# Altium schematic sheet SSFocuser-A-DRV8825.SchDoc
size A4
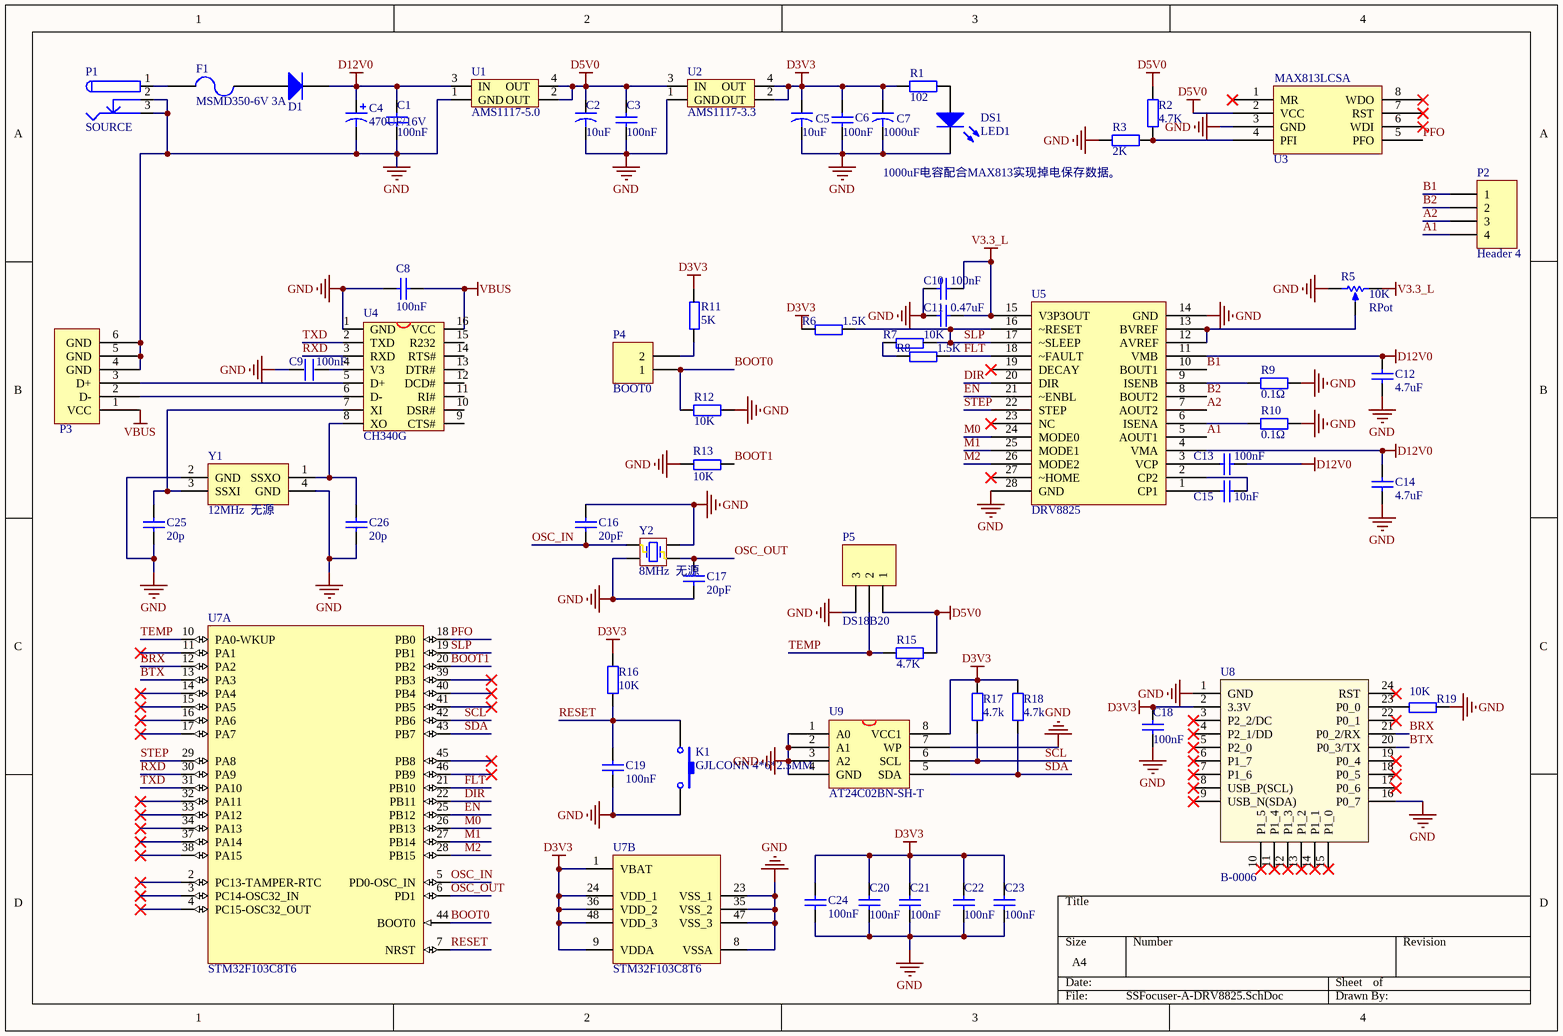
[diagram p0: SSFocuser-A-DRV8825.SchDoc]

## Parts
C1  100nF  [0603C]
C2  10uF  [3216]
C3  100nF  [0603C]
C4  470UF/16V  [16V/470U(CD10X10D5)]
C5  10uF  [3216]
C6  100nF  [0603C]
C7  1000uF  [16V/470U(CD10X10D5)]
C8  100nF  [0603C]
C9  100nF  [0603C]
C10  100nF  [0603C]
C11  0.47uF  [0603C]
C12  4.7uF  [1206C]
C13  100nF  [0603C]
C14  4.7uF  [1206C]
C15  10nF  [0603C]
C16  20pF  [0603C]
C17  20pF  [0603C]
C18  100nF  [0603C]
C19  100nF  [0603C]
C20  100nF  [0603C]
C21  100nF  [0603C]
C22  100nF  [0603C]
C23  100nF  [0603C]
C24  100nF  [0603C]
C25  20p  [0603C]
C26  20p  [0603C]
D1  M7  [DO-214AC]  (value not drawn)
DS1  LED1  [0805D]
F1  MSMD350-6V 3A  [1812R]
K1  GJLCONN 4*6*2.5MM  [SW-4*6]
P1  SOURCE  [DC_5.5MM]
P2  Header 4  [XH_4_V]
P3  USB-B  [USB-B]  (value not drawn)
P4  BOOT0  [HDR1X2]
P5  DS18B20  [TO-92B]
R1  102  [0603R]
R2  4.7K  [0603R]
R3  2K  [0603R]
R5  RPot  value 10K  [VR_SMD]
R6  1.5K  [0603R]
R7  10K  [0603R]
R8  1.5K  [0603R]
R9  0.1Ω  [1206R]
R10  0.1Ω  [1206R]
R11  5K  [0603R]
R12  10K  [0603R]
R13  10K  [0603R]
R15  4.7K  [0603R]
R16  10K  [0603R]
R17  4.7k  [0603R]
R18  4.7k  [0603R]
R19  10K  [0603R]
U1  AMS1117-5.0  [SOT223]
U2  AMS1117-3.3  [SOT223]
U3  MAX813LCSA  [SOP-8]
U4  CH340G  [SO-16]
U5  DRV8825  [HTSSOP]
U7  STM32F103C8T6  [LQFP48_N]  (parts A,B of 2)
U8  B-0006  [B-0006]
U9  AT24C02BN-SH-T  [SOP-8]
Y1  12MHz  无源  [X3225]
Y2  8MHz  无源  [X3225]

## Nets
D3V3: C5.1 C6.2 C7.1 C18.2 C20.2 C21.2 C22.2 C23.2 C24.2 R1.2 R6.1 R11.2 R16.2 R17.2 R18.2 U2.2(OUT) U2.4(OUT) U7.1(VBAT) U7.9(VDDA) U7.24(VDD_1) U7.36(VDD_2) U7.48(VDD_3) U8.2(3.3V) U9.8(VCC1)
D5V0: C2.1 C3.2 P5.1 R2.2 R15.2 U1.2(OUT) U1.4(OUT) U2.3(IN) U3.2(VCC)
D12V0: C1.2 C4.1 C12.1 C13.1 C14.1 D1.2(K) U1.3(IN) U5.4(VMA) U5.11(VMB)
GND: C1.1 C2.2 C3.1 C4.2 C5.2 C6.1 C7.2 C8.1 C9.1 C10.1 C11.1 C12.2 C14.2 C16.2 C17.2 C18.1 C19.1 C20.1 C21.1 C22.1 C23.1 C24.1 C25.2 C26.2 DS1.2(K) K1.2 P1.2 P1.3 P3.4(GND) P3.5(GND) P3.6(GND) P5.3 R3.2 R5.1(TOP) R9.1 R10.1 R12.2 R13.1 R19.2 U1.1(GND) U2.1(GND) U3.3(GND) U4.1(GND) U5.14(GND) U5.28(GND) U7.8(VSSA) U7.23(VSS_1) U7.35(VSS_2) U7.47(VSS_3) U8.1(GND) U8.16(P0_7) U9.1(A0) U9.2(A1) U9.3(A2) U9.4(GND) U9.7(WP) Y1.2(GND) Y1.4(GND) Y2.2(NA) Y2.4(NA)
V3.3_L: C10.2 C11.2 R5.2(BOT) U5.15(V3P3OUT)
VBUS: C8.2 P3.1(VCC) U4.16(VCC)
A1: P2.4 U5.5(AOUT1)
A2: P2.3 U5.7(AOUT2)
B1: P2.1 U5.10(BOUT1)
B2: P2.2 U5.8(BOUT2)
BOOT0: P4.1 R12.1 U7.44(BOOT0)
BOOT1: R13.2 U7.20(PB2)
BRX: U7.12(PA2) U8.21(P0_2/RX)
BTX: U7.13(PA3) U8.20(P0_3/TX)
DIR: U5.20(DIR) U7.22(PB11)
EN: U5.21(~ENBL) U7.25(PB12)
FLT: R8.2 U5.18(~FAULT) U7.21(PB10)
M0: U5.24(MODE0) U7.26(PB13)
M1: U5.25(MODE1) U7.27(PB14)
M2: U5.26(MODE2) U7.28(PB15)
OSC_IN: C16.1 U7.5(PD0-OSC_IN) Y2.1(OSC1)
OSC_OUT: C17.1 U7.6(PD1) Y2.3(OSC2)
PFO: U3.5(PFO) U7.18(PB0)
RESET: C19.2 K1.1 R16.1 U7.7(NRST)
RXD: U4.3(RXD) U7.30(PA9)
SCL: R17.1 U7.42(PB6) U9.6(SCL)
SDA: R18.1 U7.43(PB7) U9.5(SDA)
SLP: R6.2 R7.2 U5.16(~RESET) U5.17(~SLEEP) U7.19(PB1)
STEP: U5.22(STEP) U7.29(PA8)
TEMP: P5.2 R15.1 U7.10(PA0-WKUP)
TXD: U4.2(TXD) U7.31(PA10)
NetC9_2: C9.2 U4.4(V3)
NetC13_2: C13.2 U5.3(VCP)
NetC15_1: C15.1 U5.2(CP2)
NetC15_2: C15.2 U5.1(CP1)
NetC25_1: C25.1 U4.7(XI) Y1.3(SSXI)
NetC26_1: C26.1 U4.8(XO) Y1.1(SSXO)
NetD1_1: D1.1(A) F1.1
NetDS1_1: DS1.1(A) R1.1
NetF1_2: F1.2 P1.1
NetP3_2: P3.2(D-) U4.6(D-)
NetP3_3: P3.3(D+) U4.5(D+)
NetP4_2: P4.2 R11.1
NetR2_1: R2.1 R3.1 U3.4(PFI)
NetR5_3: R5.3(TAP) U5.12(AVREF) U5.13(BVREF)
NetR7_1: R7.1 R8.1
NetR9_2: R9.2 U5.9(ISENB)
NetR10_2: R10.2 U5.6(ISENA)
NetR19_1: R19.1 U8.23(P0_0)

Not connected (* = marked no-connect by the designer): U3 1(MR)* 6(WDI)* 7(RST)* 8(WDO)*; U4 9(CTS#) 10(DSR#) 11(RI#) 12(DCD#) 13(DTR#) 14(RTS#) 15(R232); U5 19(DECAY)* 23(NC)* 27(~HOME)*; U7 2(PC13-TAMPER-RTC)* 3(PC14-OSC32_IN)* 4(PC15-OSC32_OUT)* 11(PA1)* 14(PA4)* 15(PA5)* 16(PA6)* 17(PA7)* 32(PA11)* 33(PA12)* 34(PA13)* 37(PA14)* 38(PA15)* 39(PB3)* 40(PB4)* 41(PB5)* 45(PB8)* 46(PB9)*; U8 3(P2_2/DC)* 4(P2_1/DD)* 5(P2_0)* 6(P1_7)* 7(P1_6)* 8(USB_P(SCL))* 9(USB_N(SDA))* 10(P1_5)* 11(P1_4)* 12(P1_3)* 13(P1_2)* 14(P1_1)* 15(P1_0)* 17(P0_6)* 18(P0_5)* 19(P0_4)* 22(P0_1)* 24(RST)*

## Notes on the sheet
- 1000uF电容配合MAX813实现掉电保存数据。

## Library data of the parts
C1 C3 C6 C8 C10-C26 = Cap: Capacitor; Published: 8-Jun-2000; LatestRevisionDate: 17-Jul-2002; LatestRevisionNote: Re-released for DXP Platform.; PackageReference: RAD-0.3; Publisher: Altium Limited
  C1 C3 C6 C8 C10 C13 C18-C24: Value: 100nF
  C11: Value: 0.47uF
  C12 C14: Value: 4.7uF
  C15: Value: 10nF
  C16 C17: Value: 20pF
  C25 C26: Value: 20p
C2 C5 C7 = CAP2
  C2 C5: vaule: 10uF
  C7: vaule: 1000uF
C4 = C470UF016S: 470UF      16V      CD10X10D5
C9 = C
D1 = Diode: High Conductance Fast Diode; pin to pad: 1>2 2>1; Published: 8-Jun-2000; LatestRevisionDate: 17-Jul-2002; LatestRevisionNote: Re-released for DXP Platform.; DatasheetDocument: 1997; PackageReference: DO-35; Publisher: Altium Limited; Code_JEDEC: DO-204-AH; ComponentLink1Description: Manufacturer Link; ComponentLink1URL: http://www.fairchildsemi.com/; ComponentLink2Description: Datasheet; ComponentLink2URL: http://www.fairchildsemi.com/ds/1N%2F1N4448.pdf
DS1 = LED2: Typical RED, GREEN, YELLOW, AMBER GaAs LED; Published: 8-Jun-2000; LatestRevisionDate: 17-Jul-2002; LatestRevisionNote: Re-released for DXP Platform.; PackageDocument: Feb-2002; PackageReference: 3.2X1.6X1.1; Publisher: Altium Limited
F1 = FUSE2: Fuse
K1 = KEY2: Switch; Published: 24-Mar-1999; LatestRevisionDate: 17-Jul-2002; LatestRevisionNote: Re-released for DXP Platform.; PackageReference: SPST-2; Publisher: Altium Limited
P2 = Header 4: Header, 4-Pin; LatestRevisionDate: 17-Jul-2002; LatestRevisionNote: Re-released for DXP Platform.; Publisher: Altium Limited
P4 = MHDR1X2: Header, 2-Pin; LatestRevisionDate: 17-Jul-2002; LatestRevisionNote: Re-released for DXP Platform.; Publisher: Altium Limited
P5 = Header 3: Header, 3-Pin; LatestRevisionDate: 17-Jul-2002; LatestRevisionNote: Re-released for DXP Platform.; Publisher: Altium Limited
R1-R3 R9 R10 R12 R15-R18 = RES: Resistor; Value: 1K; Published: 8-Jun-2000; Revision: July-2002: Re-released for DXP Platform.; Publisher: Altium Limited
R5 = RPot: Potentiometer; Sim Note: Enter the Resistance value and the set point into parameter fields.; Set Position: 0.5; Published: 8-Jun-2000; LatestRevisionDate: 17-Jul-2002; LatestRevisionNote: Re-released for DXP Platform.; PackageReference: VR5; Publisher: Altium Limited; PackageDescription: Variable Resistor, Thru-Hole; 3 Leads
R6-R8 R11 R13 R19 = R
U1 U2 = AMS1117
U3 = MAX813L
U4 = CH340G: USB2UART
U7 = STM32F103C8T6: STM32 ARM-based 32-bit MCU Performance Line with 64 kB Flash, 20 kB Internal RAM, -40 to +85癈 Temperature, 48-Pin LQFP, Tray; DatasheetVersion: rev13.0, Apr-2011; PackageVersion: rev13, Apr-2011; PackageReference: LQFP48; PackageDescription: 48-Pin Low-Profile Quad Flat Pack, 7 x 7 mm Body, 0.5 mm Pitch (LQFP48); ComponentLink1Description: Manufacturer URL; ComponentLink1URL: http://www.st.com/; ComponentLink2Description: STM32F103 Datasheet; ComponentLink2URL: http://www.st.com/internet/com/TECHNICAL_RESOURCES/TECHNICAL_LITERATURE/DATASHEET/CD00161566.pdf; ComponentLink3Description: STM32 Family Web Page; ComponentLink3URL: www.st.com/stm32
U9 = 24C256
Y1 = XTAL_3225
Y2 = XTAL_1: Crystal Oscillator; Published: 8-Jun-2000; LatestRevisionDate: 17-Jul-2002; LatestRevisionNote: Re-released for DXP Platform.; PackageReference: R38; Publisher: Altium Limited; Value: 8MHz  无源
P1 = SOURCE: LatestRevisionDate: 17-Jul-2002; LatestRevisionNote: Re-released for DXP Platform.; Publisher: Altium Limited